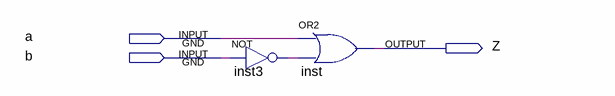
[diagram p0: schematic sheet]
// Quartus schematic 1-6.bdf as structural Verilog: 2 symbols, 3 pins
module \1-6  (
  input  a,
  input  b,
  output Z
);

  wire inst3_out;

  not inst3 (inst3_out, b);
  or inst (Z, a, inst3_out);
endmodule
